# EAGLE schematic attiny_sensor2 (EAGLE 9.6.2)
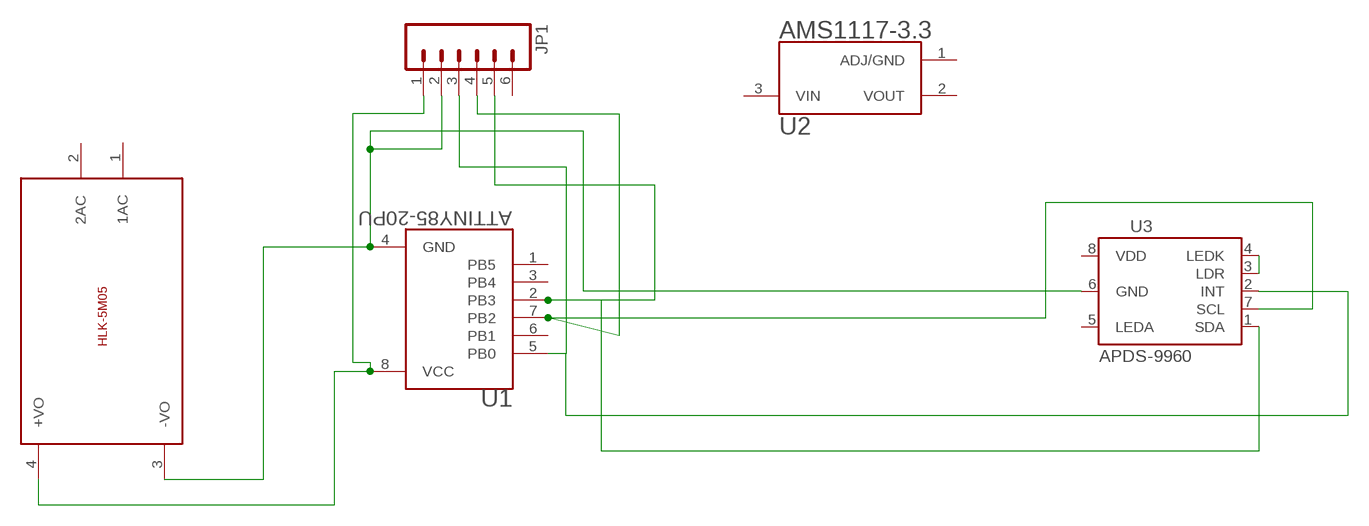
[diagram p0: schematic, sheet 1]

## Parts
JP1  M06SIP  [1X06]
U1  ATTINY85-20PU  [DIP762W46P254L927H533Q8B]
U2  AMS1117-3.3  [SOT229P700X180-4N]
U3  APDS-9960  [APDS-9960]
U$1  5VDC/5W  HLK-5M05  [HLK-5M05]

## Nets
N$1: JP1.1 U1.8(VCC) U$1.4(+VO)
N$2: JP1.4 U1.7(PB2) U3.7(SCL)
N$3: JP1.5 U1.2(PB3) U3.1(SDA)
N$4: JP1.3 U1.5(PB0) U3.2(INT)
N$6: U3.3(LDR) U3.4(LEDK)
N$7: JP1.2 U1.4(GND) U3.6(GND) U$1.3(-VO)
Unconnected: JP1.6 U1.1(PB5) U1.3(PB4) U1.6(PB1) U2.2(VOUT) U2.3(VIN) U3.5(LEDA) U3.8(VDD) U$1.1(1AC) U$1.2(2AC)

## Power pins joined to a net without a drawn wire
ADJ/GND: U2.1(ADJ/GND)

## Library data of the parts
JP1 = SparkFun-Connectors:M06: Header 6 Standard 6-pin 0.1" header. Use with straight break away headers (SKU : PRT-00116), right angle break away headers (PRT-00553), swiss pins (PRT-00743), machine pins (PRT-00117), and female headers (PRT-00115). Molex polarized connector foot print use with SKU : PRT-08094 with associated crimp pins and housings. NOTES ON THE VARIANTS LOCK and LOCK_LONGPADS... This footprint was designed to help hold the alignment of a through-hole component (i.e. 6-pin header) while soldering it into place. You may notice that each hole has been shifted either up or down by 0.005 of an inch from it's more standard position (which is a perfectly straight line). This slight alteration caused the pins (the squares in the middle) to touch the edges of the holes. Because they are alternating, it causes a "brace" to hold the component in place. 0.005 has proven to be the perfect amount of "off-center" position when using our standard breakaway headers. Although looks a little odd when you look at the bare footprint, once you have a header in there, the alteration is very hard to notice. Also,if you push a header all the way into place, it is covered up entirely on the bottom side. This idea of altering the position of holes to aid alignment will be further integrated into the Sparkfun Library for other footprints. It can help hold any component with 3 or more connection pins.
U1 = ATTINY85-20PU:ATTINY85-20PU: ATtiny Series 20 MHz 8 KB Flash 512 B SRAM 8-Bit Microcontroller - DIP-8 Check prices <https://pricing.snapeda.com/parts/ATTINY85-20PU/Microchip%20Technology/view-part?ref=eda>; AVAILABILITY: Warning; DESCRIPTION: AVR AVR® ATtiny, Functional Safety (FuSa) Microcontroller IC 8-Bit 20MHz 8KB (4K x 16) FLASH 8-PDIP; MF: Microchip Technology; MP: ATTINY85-20PU; PACKAGE: DIP-8 Atmel; PRICE: None; PURCHASE-URL: https://pricing.snapeda.com/search/part/ATTINY85-20PU/?ref=eda
U2 = AMS1117-3.3:AMS1117-3.3: Sot223/Pkg 1-Amp 3.3-Volt Low Drop Out Voltage Regulatator; AVAILABILITY: Unavailable; DESCRIPTION: Sot223/Pkg 1-Amp 3.3-Volt Low Drop Out Voltage Regulatator; MF: Advanced Monolithic Systems; MP: AMS1117-3.3; PACKAGE: SOT-89 ams; PRICE: None
U3 = SparkFun-Sensors:APDS-9960: Avago APDS-9960 digital proximity, ambient light, RGB, and gesture sensor.; PROD_ID: SEN-12005
U$1 = HLK-5M05:HLK-5M05: HLK-5M05 is an 5Volt/5W smps developed by HI-LINK; SIZE: 23x38(mm)